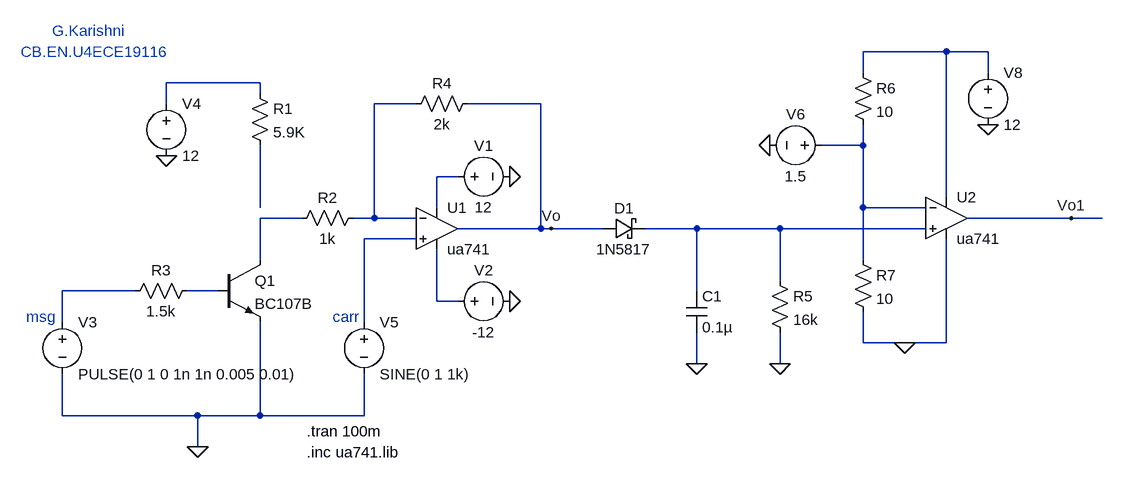
[diagram p0: schematic Draft_demodulation.asc]
Draft_demodulation.asc, the LTspice schematic file:
Version 4
SHEET 1 1648 680
WIRE 1248 -80 1120 -80
WIRE 1312 -80 1248 -80
WIRE 1120 -48 1120 -80
WIRE 1312 -48 1312 -80
WIRE 192 -32 48 -32
WIRE 192 -16 192 -32
WIRE 48 0 48 -32
WIRE 432 0 368 0
WIRE 624 0 512 0
WIRE 1120 64 1120 32
WIRE 1120 64 1056 64
WIRE 496 112 464 112
WIRE 1248 144 1248 -80
WIRE 192 160 192 64
WIRE 464 160 464 112
WIRE 1120 160 1120 64
WIRE 1216 160 1120 160
WIRE 256 176 192 176
WIRE 368 176 368 0
WIRE 368 176 336 176
WIRE 432 176 368 176
WIRE 1440 176 1280 176
WIRE 1488 176 1440 176
WIRE 624 192 624 0
WIRE 624 192 496 192
WIRE 640 192 624 192
WIRE 720 192 640 192
WIRE 864 192 784 192
WIRE 992 192 864 192
WIRE 1216 192 992 192
WIRE 432 208 352 208
WIRE 192 240 192 176
WIRE 1120 240 1120 160
WIRE 992 272 992 192
WIRE 0 288 -112 288
WIRE 128 288 80 288
WIRE 864 288 864 192
WIRE 464 304 464 224
WIRE 496 304 464 304
WIRE -112 336 -112 288
WIRE 352 336 352 208
WIRE 1120 368 1120 320
WIRE 1184 368 1120 368
WIRE 1248 368 1248 208
WIRE 1248 368 1184 368
WIRE 864 400 864 352
WIRE 992 400 992 352
WIRE -112 480 -112 416
WIRE 96 480 -112 480
WIRE 192 480 192 336
WIRE 192 480 96 480
WIRE 352 480 352 416
WIRE 352 480 192 480
WIRE 96 528 96 480
FLAG 48 80 0
FLAG 576 304 0
FLAG 576 112 0
FLAG 96 528 0
FLAG 640 192 Vo
FLAG 976 64 0
FLAG 1312 32 0
FLAG 1184 368 0
FLAG 864 400 0
FLAG 992 400 0
FLAG 1440 176 Vo1
SYMBOL res 176 -32 R0
SYMATTR InstName R1
SYMATTR Value 5.9K
SYMATTR SpiceLine tol=1 pwr=0.1
SYMBOL res 352 160 R90
WINDOW 0 0 56 VBottom 2
WINDOW 3 32 56 VTop 2
SYMATTR InstName R2
SYMATTR Value 1k
SYMBOL res 96 272 R90
WINDOW 0 0 56 VBottom 2
WINDOW 3 32 56 VTop 2
SYMATTR InstName R3
SYMATTR Value 1.5k
SYMBOL npn 128 240 R0
SYMATTR InstName Q1
SYMATTR Value BC107B
SYMBOL OpAmps\\ua741 464 128 R0
SYMATTR InstName U1
SYMBOL res 528 -16 R90
WINDOW 0 0 56 VBottom 2
WINDOW 3 32 56 VTop 2
SYMATTR InstName R4
SYMATTR Value 2k
SYMBOL voltage 480 112 R270
WINDOW 0 32 56 VTop 2
WINDOW 3 -32 56 VBottom 2
WINDOW 123 0 0 Left 0
WINDOW 39 0 0 Left 0
SYMATTR InstName V1
SYMATTR Value 12
SYMBOL voltage 480 304 R270
WINDOW 0 32 56 VTop 2
WINDOW 3 -32 56 VBottom 2
WINDOW 123 0 0 Left 0
WINDOW 39 0 0 Left 0
SYMATTR InstName V2
SYMATTR Value -12
SYMBOL voltage -112 320 R0
WINDOW 123 0 0 Left 0
WINDOW 39 0 0 Left 0
SYMATTR InstName V3
SYMATTR Value PULSE(0 1 0 1n 1n 0.005 0.01)
SYMBOL voltage 352 320 R0
WINDOW 123 0 0 Left 0
WINDOW 39 0 0 Left 0
SYMATTR InstName V5
SYMATTR Value SINE(0 1 1k)
SYMBOL schottky 720 208 R270
WINDOW 0 32 32 VTop 2
WINDOW 3 0 32 VBottom 2
SYMATTR InstName D1
SYMATTR Value 1N5817
SYMATTR Description Diode
SYMATTR Type diode
SYMBOL OpAmps\\ua741 1248 112 R0
SYMATTR InstName U2
SYMBOL voltage 1072 64 R90
WINDOW 0 -32 56 VBottom 2
WINDOW 3 32 56 VTop 2
WINDOW 123 0 0 Left 0
WINDOW 39 0 0 Left 0
SYMATTR InstName V6
SYMATTR Value 1.5
SYMBOL res 1104 -64 R0
SYMATTR InstName R6
SYMATTR Value 10
SYMBOL res 1104 224 R0
SYMATTR InstName R7
SYMATTR Value 10
SYMBOL voltage 1312 -64 R0
WINDOW 123 0 0 Left 0
WINDOW 39 0 0 Left 0
SYMATTR InstName V8
SYMATTR Value 12
SYMBOL cap 848 288 R0
SYMATTR InstName C1
SYMATTR Value 0.1µ
SYMBOL res 976 256 R0
SYMATTR InstName R5
SYMATTR Value 16k
SYMATTR SpiceLine tol=1 pwr=0.1
SYMBOL voltage 48 -16 R0
WINDOW 123 0 0 Left 0
WINDOW 39 0 0 Left 0
SYMATTR InstName V4
SYMATTR Value 12
TEXT -168 328 Left 2 ;msg
TEXT 304 328 Left 2 ;carr
TEXT 264 504 Left 2 !.tran 100m
TEXT 264 536 Left 2 !.inc ua741.lib
TEXT -128 -112 Left 2 ;G.Karishni
TEXT -176 -80 Left 2 ;CB.EN.U4ECE19116

The netlist it stands for:
* Draft_demodulation.asc
R1 N002 N006 5.9K tol=1 pwr=0.1
R2 N003 N007 1k
R3 N011 N010 1.5k
Q1 N007 N011 0 0 BC107B
XU1 N009 N003 N005 N012 Vo ua741  ; pins In+ In- V+ V- OUT
R4 Vo N003 2k
V1 N005 0 12
V2 N012 0 -12
V3 N010 0 PULSE(0 1 0 1n 1n 0.005 0.01)
V5 N009 0 SINE(0 1 1k)
D1 Vo N008 1N5817
XU2 N008 N004 N001 0 Vo1 ua741  ; pins In+ In- V+ V- OUT
V6 N004 0 1.5
R6 N001 N004 10
R7 N004 0 10
V8 N001 0 12
C1 N008 0 0.1µ
R5 N008 0 16k tol=1 pwr=0.1
V4 N002 0 12
.model D D
.lib standard.dio
.model NPN NPN
.model PNP PNP
.lib standard.bjt
* msg
* carr
.tran 100m
.inc ua741.lib
* G.Karishni
* CB.EN.U4ECE19116
.backanno
.end